# EAGLE design mux_board_final (EAGLE 6.6.0)
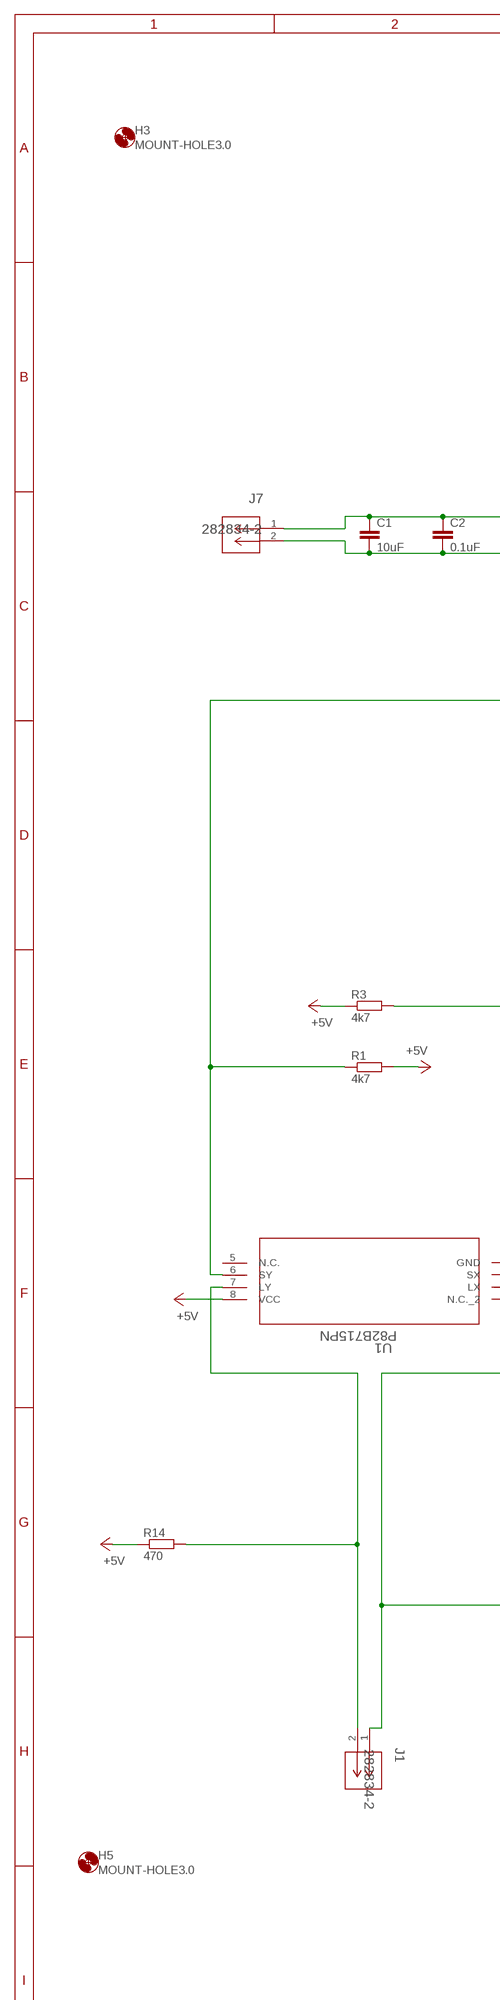
[diagram p0: schematic, sheet 1, part 1 of 2]
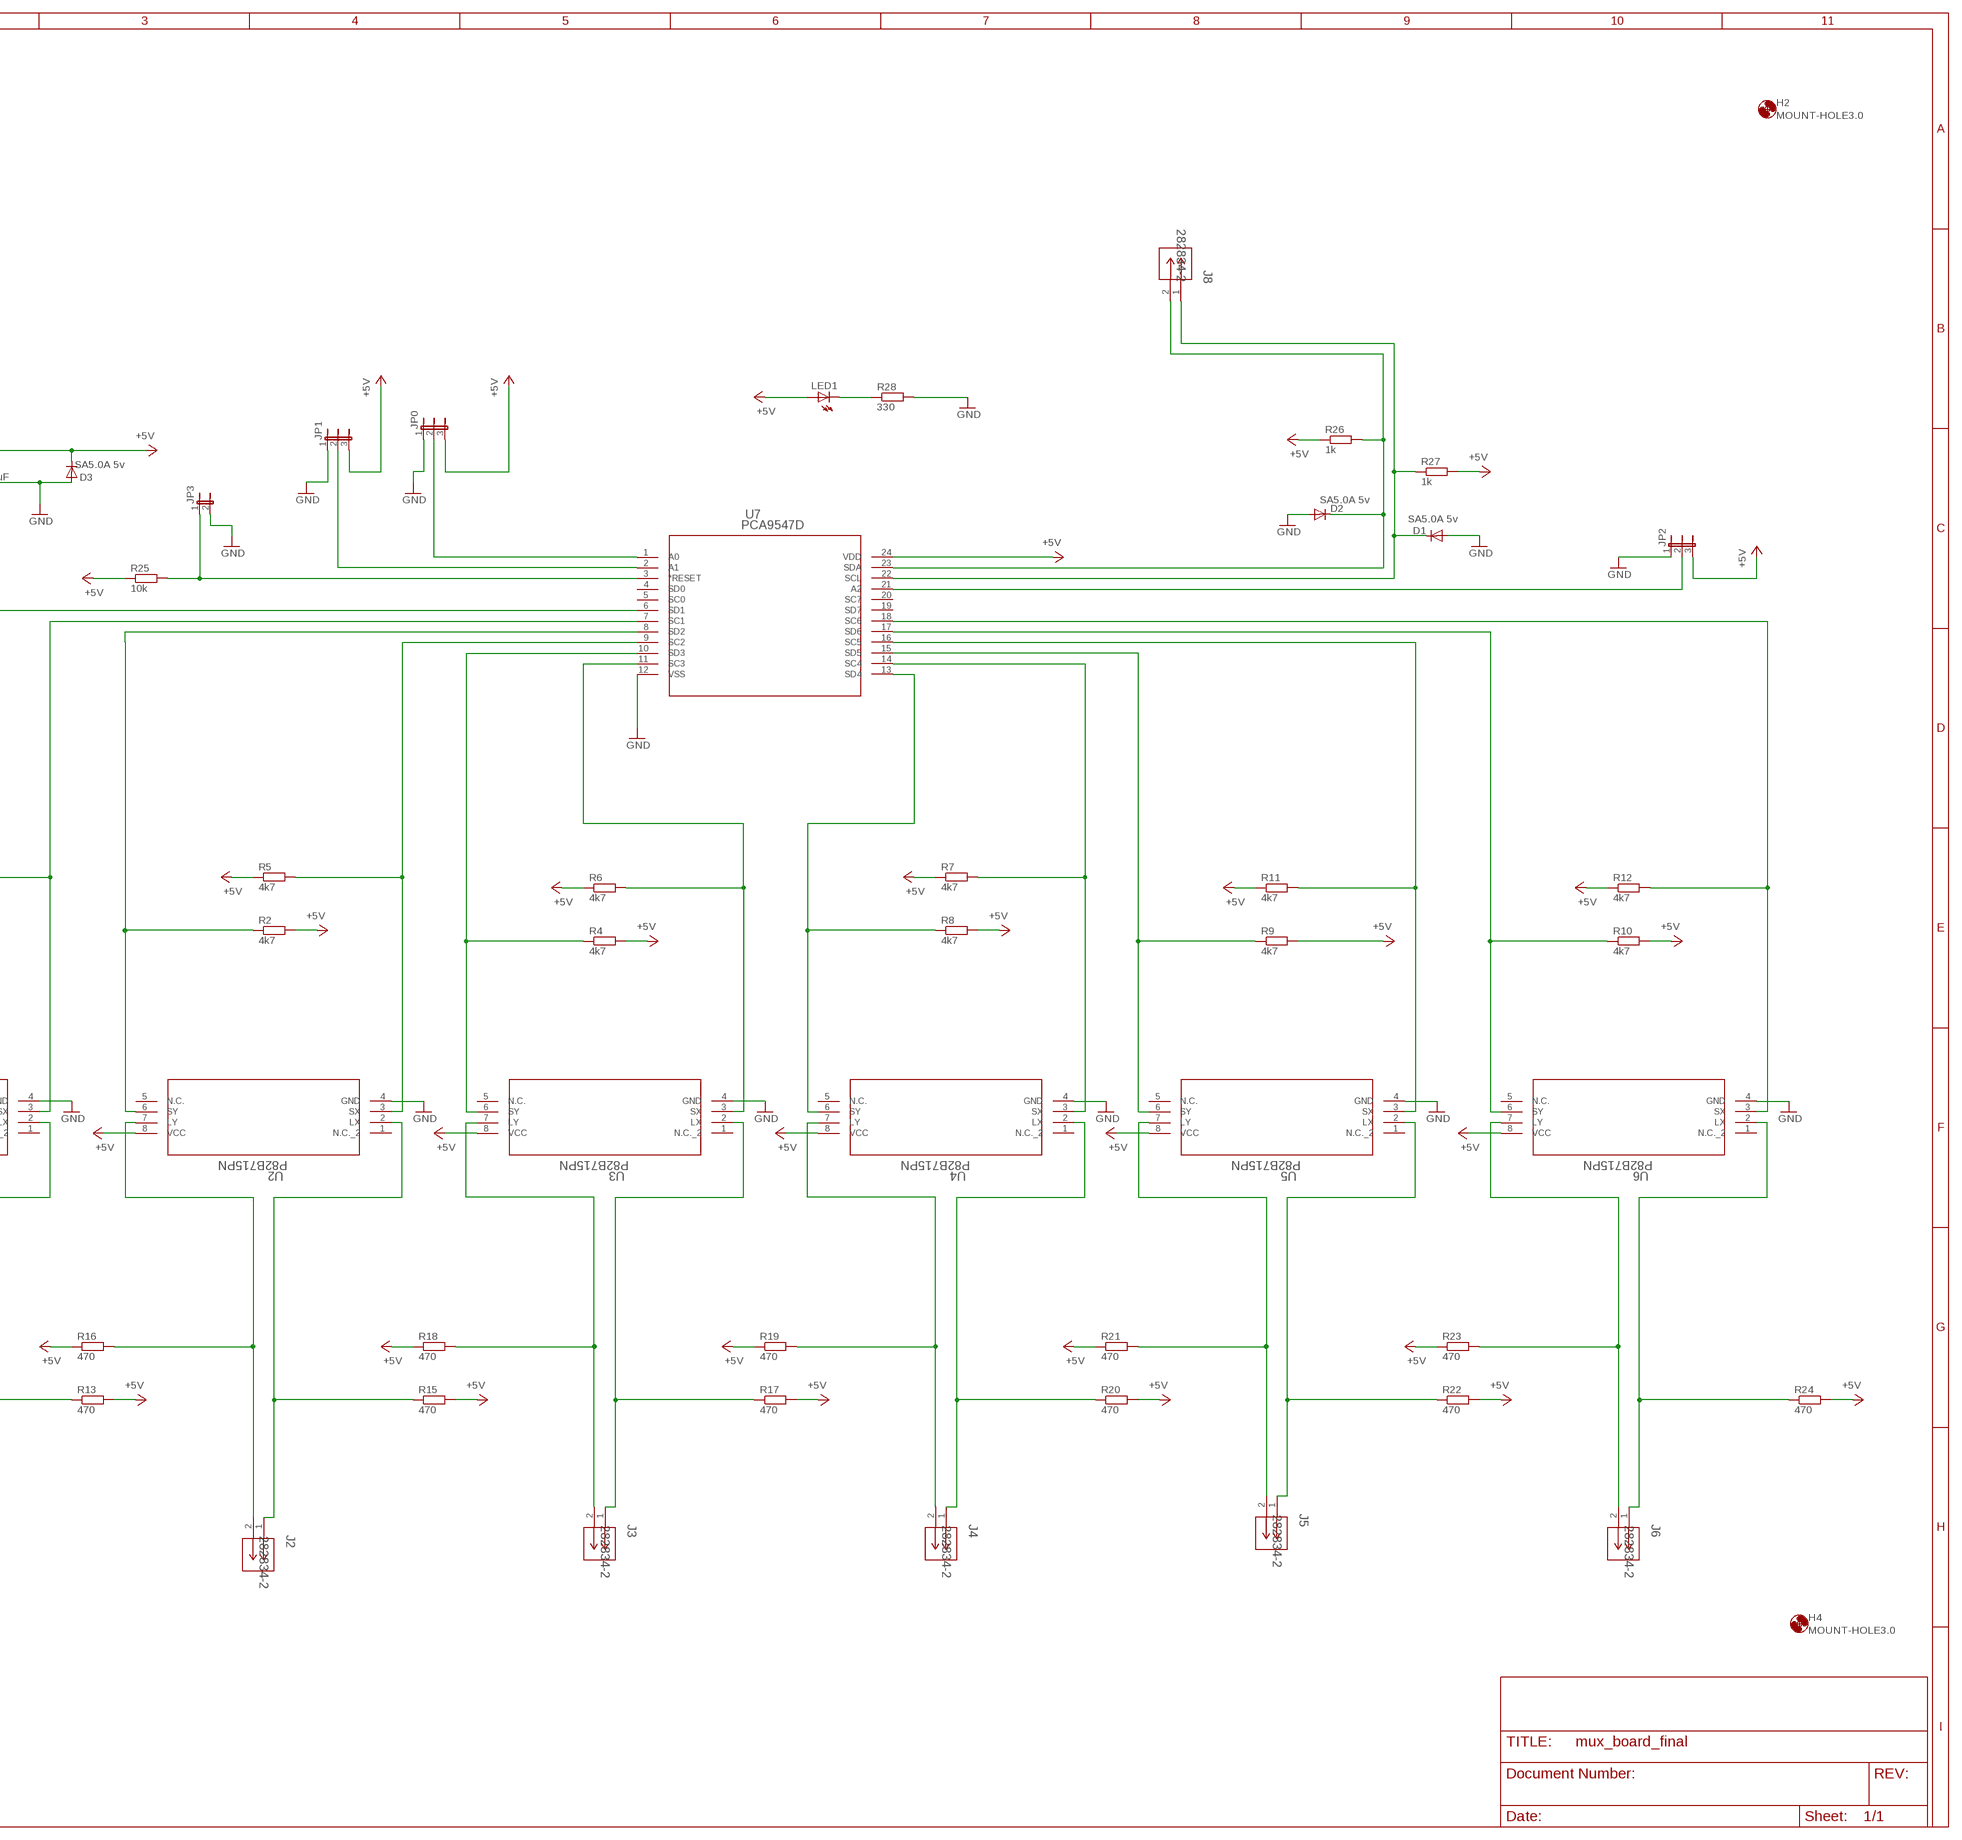
[diagram p1: schematic, sheet 1, part 2 of 2]

## Parts
C1  10uF  C-EU025-025X050  [C025-025X050]
C2  0.1uF  C-EU025-025X050  [C025-025X050]
D1  SA5.0A 5v  1N4004  [DO41-10]
D2  SA5.0A 5v  1N4004  [DO41-10]
D3  SA5.0A 5v  1N4004  [DO41-10]
H2  MOUNT-HOLE3.0  [3,0]
H3  MOUNT-HOLE3.0  [3,0]
H4  MOUNT-HOLE3.0  [3,0]
H5  MOUNT-HOLE3.0  [3,0]
J1  282834-2  [CONN_282834-2]
J2  282834-2  [CONN_282834-2]
J3  282834-2  [CONN_282834-2]
J4  282834-2  [CONN_282834-2]
J5  282834-2  [CONN_282834-2]
J6  282834-2  [CONN_282834-2]
J7  282834-2  [CONN_282834-2]
J8  282834-2  [CONN_282834-2]
JP0  JP2E  [JP2]
JP1  JP2E  [JP2]
JP2  JP2E  [JP2]
JP3  JP1E  [JP1]
LED1  LED3MM  [LED3MM]
R1  4k7  R-EU_0204/7  [0204/7]
R2  4k7  R-EU_0204/7  [0204/7]
R3  4k7  R-EU_0204/7  [0204/7]
R4  4k7  R-EU_0204/7  [0204/7]
R5  4k7  R-EU_0204/7  [0204/7]
R6  4k7  R-EU_0204/7  [0204/7]
R7  4k7  R-EU_0204/7  [0204/7]
R8  4k7  R-EU_0204/7  [0204/7]
R9  4k7  R-EU_0204/7  [0204/7]
R10  4k7  R-EU_0204/7  [0204/7]
R11  4k7  R-EU_0204/7  [0204/7]
R12  4k7  R-EU_0204/7  [0204/7]
R13  470  R-EU_0204/7  [0204/7]
R14  470  R-EU_0204/7  [0204/7]
R15  470  R-EU_0204/7  [0204/7]
R16  470  R-EU_0204/7  [0204/7]
R17  470  R-EU_0204/7  [0204/7]
R18  470  R-EU_0204/7  [0204/7]
R19  470  R-EU_0204/7  [0204/7]
R20  470  R-EU_0204/7  [0204/7]
R21  470  R-EU_0204/7  [0204/7]
R22  470  R-EU_0204/7  [0204/7]
R23  470  R-EU_0204/7  [0204/7]
R24  470  R-EU_0204/7  [0204/7]
R25  10k  R-EU_0204/7  [0204/7]
R26  1k  R-EU_0204/7  [0204/7]
R27  1k  R-EU_0204/7  [0204/7]
R28  330  R-EU_0204/7  [0204/7]
U1  P82B715PN  [SOT97-1]
U2  P82B715PN  [SOT97-1]
U3  P82B715PN  [SOT97-1]
U4  P82B715PN  [SOT97-1]
U5  P82B715PN  [SOT97-1]
U6  P82B715PN  [SOT97-1]
U7  PCA9547D  [SOT137-1]

## Nets
+5V: C1.1 C2.1 D3.C J7.1 JP0.3 JP1.3 JP2.3 LED1.A R1.2 R2.2 R3.1 R4.2 R5.1 R6.1 R7.1 R8.2 R9.2 R10.2 R11.1 R12.1 R13.2 R14.1 R15.2 R16.1 R17.2 R18.1 R19.1 R20.2 R21.1 R22.2 R23.1 R24.2 R25.1 R26.1 R27.2 U1.8(VCC) U2.8(VCC) U3.8(VCC) U4.8(VCC) U5.8(VCC) U6.8(VCC) U7.24(VDD)
GND: C1.2 C2.2 D1.A D2.A D3.A J7.2 JP0.1 JP1.1 JP2.1 JP3.2 R28.2 U1.4(GND) U2.4(GND) U3.4(GND) U4.4(GND) U5.4(GND) U6.4(GND) U7.12(VSS)
N$1: R1.1 U1.6(SY) U7.6(SD1)
N$2: R2.1 U2.6(SY) U7.8(SD2)
N$3: R3.2 U1.3(SX) U7.7(SC1)
N$4: R5.2 U2.3(SX) U7.9(SC2)
N$5: R4.1 U3.6(SY) U7.10(SD3)
N$6: R6.2 U3.3(SX) U7.11(SC3)
N$7: R8.1 U4.6(SY) U7.13(SD4)
N$8: R7.2 U4.3(SX) U7.14(SC4)
N$9: R9.1 U5.6(SY) U7.15(SD5)
N$10: R11.2 U5.3(SX) U7.16(SC5)
N$11: R10.1 U6.6(SY) U7.17(SD6)
N$12: R12.2 U6.3(SX) U7.18(SC6)
N$14: JP0.2 U7.1(A0)
N$15: JP1.2 U7.2(A1)
N$16: JP2.2 U7.21(A2)
N$19: J1.2 R14.2 U1.7(LY)
N$20: JP3.1 R25.2 U7.3(*RESET)
N$21: J2.2 R16.2 U2.7(LY)
N$22: J2.1 R15.1 U2.2(LX)
N$23: J3.2 R18.2 U3.7(LY)
N$24: J3.1 R17.1 U3.2(LX)
N$25: J4.2 R19.2 U4.7(LY)
N$26: J4.1 R20.1 U4.2(LX)
N$27: J5.2 R21.2 U5.7(LY)
N$28: J5.1 R22.1 U5.2(LX)
N$29: J6.2 R23.2 U6.7(LY)
N$30: J6.1 R24.1 U6.2(LX)
N$31: D1.C J8.1 R27.1 U7.22(SCL)
N$33: LED1.K(C) R28.1
N$34: D2.C J8.2 R26.2 U7.23(SDA)
TSR1: J1.1 R13.1 U1.2(LX)
Unconnected: U1.1(N.C._2) U1.5(N.C.) U2.1(N.C._2) U2.5(N.C.) U3.1(N.C._2) U3.5(N.C.) U4.1(N.C._2) U4.5(N.C.) U5.1(N.C._2) U5.5(N.C.) U6.1(N.C._2) U6.5(N.C.) U7.4(SD0) U7.5(SC0) U7.19(SD7) U7.20(SC7)

## Library data of the parts
C1 C2 = rcl:C-EU: CAPACITOR, European symbol
D1-D3 = diode:1N4004: DIODE general purpose rectifier, 1 A
H2-H5 = holes:MOUNT-HOLE: MOUNTING HOLE with drill center marker
J1-J8 = screw-terminals:282834-2: 2.54mm pitch; DESCRIPTION: Termi-Block 2 way pcb r/a; FAMILY: Terminal Blocks; MANUFACTURER_NAME: Tyco Electronics Amp; MANUFACTURER_PART_NUMBER: 282834-2; RSPARTNUMBER: 7100104; SECTION: General Purpose; SUPERSECTION: Connectors; VENDOR: Tyco Electronics
JP0 JP1 JP2 = jumper:JP2E: JUMPER
JP3 = jumper:JP1E: JUMPER
LED1 = led:LED: LED OSRAM: - CHIPLED LG R971, LG N971, LY N971, LG Q971, LY Q971, LO R971, LY R971 LH N974, LH R974 LS Q976, LO Q976, LY Q976 LO Q996 - Hyper CHIPLED LW Q18S LB Q993, LB Q99A, LB R99A - SideLED LS A670, LO A670, LY A670, LG A670, LP A670 LB A673, LV A673, LT A673, LW A673 LH A674 LY A675 LS A676, LA A676, LO A676, LY A676, LW A676 LS A679, LY A679, LG A679 - Hyper Micro SIDELED® LS Y876, LA Y876, LO Y876, LY Y876 LT Y87S - SmartLED LW L88C, LW L88S LB L89C, LB L89S, LG L890 LS L89K, LO L89K, LY L89K LS L896, LA L896, LO L896, LY L896 - TOPLED LS T670, LO T670, LY T670, LG T670, LP T670 LSG T670, LSP T670, LSY T670, LOP T670, LYG T670 LG T671, LOG T671, LSG T671 LB T673, LV T673, LT T673, LW T673 LH T674 LS T676, LA T676, LO T676, LY T676, LB T676, LH T676, LSB T676, LW T676 LB T67C, LV T67C, LT T67C, LS T67K, LO T67K, LY T67K, LW E67C LS E67B, LA E67B, LO E67B, LY E67B, LB E67C, LV E67C, LT E67C LW T67C LS T679, LY T679, LG T679 LS T770, LO T770, LY T770, LG T770, LP T770 LB T773, LV T773, LT T773, LW T773 LH T774 LS E675, LA E675, LY E675, LS T675 LS T776, LA T776, LO T776, LY T776, LB T776 LHGB T686 LT T68C, LB T68C - Hyper Mini TOPLED® LB M676 - Mini TOPLED Santana® LG M470 LS M47K, LO M47K, LY M47K Source: http://www.osram.convergy.de LUXEON: - LUMILED® LXK2-PW12-R00, LXK2-PW12-S00, LXK2-PW14-U00, LXK2-PW14-V00 LXK2-PM12-R00, LXK2-PM12-S00, LXK2-PM14-U00 LXK2-PE12-Q00, LXK2-PE12-R00, LXK2-PE12-S00, LXK2-PE14-T00, LXK2-PE14-U00 LXK2-PB12-K00, LXK2-PB12-L00, LXK2-PB12-M00, LXK2-PB14-N00, LXK2-PB14-P00, LXK2-PB14-Q00 LXK2-PR12-L00, LXK2-PR12-M00, LXK2-PR14-Q00, LXK2-PR14-R00 LXK2-PD12-Q00, LXK2-PD12-R00, LXK2-PD12-S00 LXK2-PH12-R00, LXK2-PH12-S00 LXK2-PL12-P00, LXK2-PL12-Q00, LXK2-PL12-R00 Source: www.luxeon.com KINGBRIGHT: KA-3528ASYC Source: www.kingbright.com
R1-R28 = rcl:R-EU_: RESISTOR, European symbol
U1-U6 = testlib:P82B715PN; DESCRIPTION: I2C bus extender/driver,P82B715PN DIL8; FAMILY: Unknown; MANUFACTURER_NAME: NXP; MANUFACTURER_PART_NUMBER: P82B715PN; RSPARTNUMBER: 821784; SECTION: Unknown; VENDOR: NXP
U7 = testlib:PCA9547D; DESCRIPTION: I2C Multiplexer 1Element 8IN 24P SO Tube; FAMILY: Unknown; MANUFACTURER_NAME: NXP; MANUFACTURER_PART_NUMBER: PCA9547D; RSPARTNUMBER: 7258877; SECTION: Unknown; VENDOR: NXP

## Net classes
0 default: clearance 0.205 mm

## Board
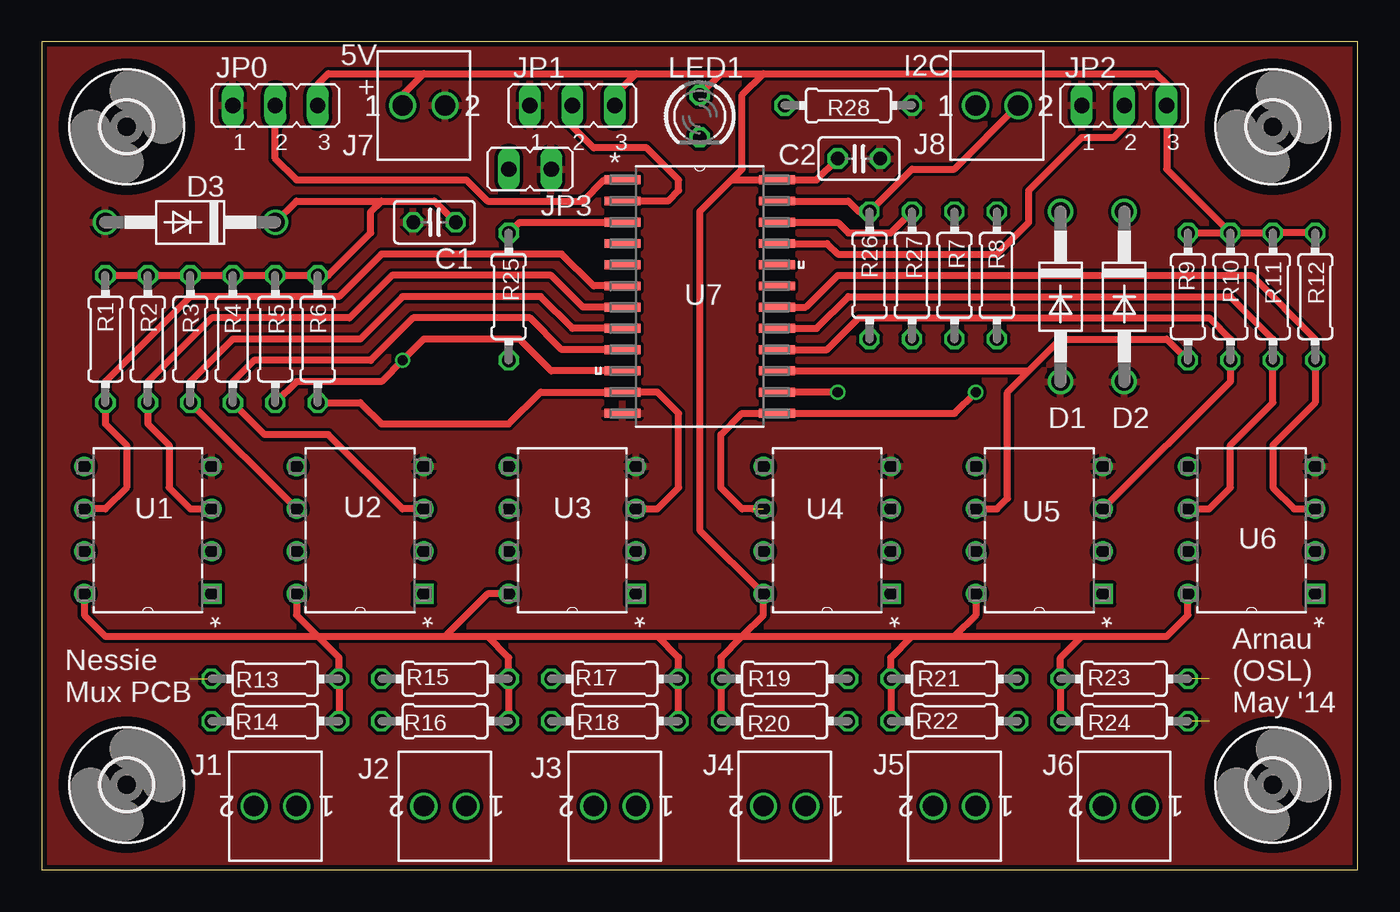
[diagram p2: board, top side]
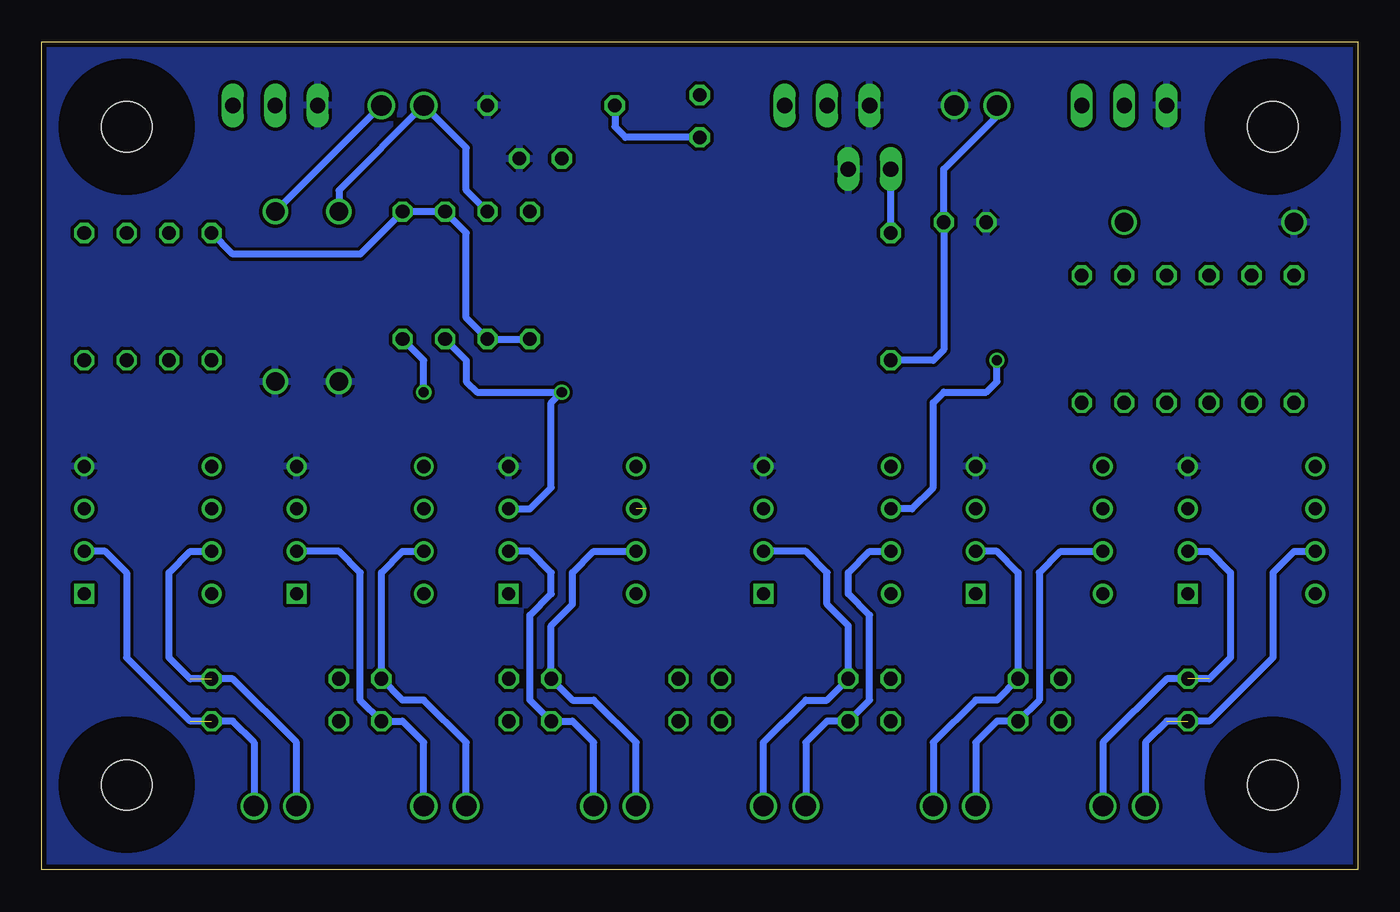
[diagram p3: board, bottom side, seen from below]

Size 78.74 x 49.53 mm. Coordinates in mm from the lower left corner, seen from the top.
Outline: 0,0 78.74,0 78.74,49.53 0,49.53 0,0
Copper layers (1*16): Top 0.035mm / dielectric 1.5mm / Bottom 0.035mm
Design rules "PCB-POOL Standard": minimum track width 0.15mm, minimum drill 0.3mm, track to track 0.15mm, track to pad 0.15mm, pad to pad 0.15mm, via to via 0.15mm, smd to smd 0.15mm, copper to edge 0.3mm, drill to drill 0.2mm, minimum pad ring 0.2mm, minimum via ring 0.15mm, stop-mask expansion 0.075mm, vias tented up to drill 0mil, thermal gap 0.2mm

### Footprints (pad centres in the part's own frame; a part is rotated, then mirrored left to right if it is on the bottom)
C025-025X050 = drill 0.813 octagon: 1 -1.27,0; 2 1.27,0
DO41-10 = drill 1.118: A 5.08,0; C -5.08,0
3,0 = hole 3: 0,0
CONN_282834-2 = drill 1.219: 1 -2.54,0; 2 0,0
JP2 = drill 0.914 long: 1 -2.54,0; 2 0,0; 3 2.54,0
JP1 = drill 0.914 long: 1 0,-1.27; 2 0,1.27
LED3MM = drill 0.813 octagon: A -1.27,0; K 1.27,0
0204/7 = drill 0.813 octagon: 1 -3.81,0; 2 3.81,0
SOT97-1 = drill 0.787 square: 1 -7.62,7.62 | drill 0.787: 2 -7.62,5.08; 3 -7.62,2.54; 4 -7.62,0; 5 0,0; 6 0,2.54; 7 0,5.08; 8 0,7.62
SOT137-1 = smd 2.134 x 0.533: 1 -4.623,6.985; 2 -4.623,5.715; 3 -4.623,4.445; 4 -4.623,3.175; 5 -4.623,1.905; 6 -4.623,0.635; 7 -4.623,-0.635; 8 -4.623,-1.905; 9 -4.623,-3.175; 10 -4.623,-4.445; 11 -4.623,-5.715; 12 -4.623,-6.985; 13 4.623,-6.985; 14 4.623,-5.715; 15 4.623,-4.445; 16 4.623,-3.175; 17 4.623,-1.905; 18 4.623,-0.635; 19 4.623,0.635; 20 4.623,1.905; 21 4.623,3.175; 22 4.623,4.445; 23 4.623,5.715; 24 4.623,6.985

### Placement (x,y rotation side)
C1  23.5,38.73 180 top
C2  48.9,42.55 0 top
D1  60.96,34.29 270 top
D2  64.77,34.29 270 top
D3  8.89,38.73 180 top
H2  73.66,44.45 0 top
H3  5.08,44.45 0 top
H4  73.66,5.08 0 top
H5  5.08,5.08 0 top
J1  12.7,3.81 180 top
J2  22.86,3.81 180 top
J3  33.02,3.81 180 top
J4  43.18,3.81 180 top
J5  53.34,3.81 180 top
J6  63.5,3.81 180 top
J7  24.13,45.72 0 top
J8  58.42,45.72 0 top
JP0  13.97,45.72 0 top
JP1  31.75,45.72 0 top
JP2  64.77,45.72 0 top
JP3  29.21,41.91 270 top
LED1  39.37,45.09 270 top
R1  3.81,31.75 90 top
R2  8.89,31.75 90 top
R3  6.35,31.75 270 top
R4  13.97,31.75 90 top
R5  11.43,31.75 270 top
R6  16.51,31.75 270 top
R7  54.61,35.56 270 top
R8  57.15,35.56 90 top
R9  68.58,34.29 90 top
R10  73.66,34.29 90 top
R11  71.12,34.29 270 top
R12  76.2,34.29 270 top
R13  13.97,11.43 0 top
R14  13.97,8.89 180 top
R15  24.13,11.43 0 top
R16  24.13,8.89 180 top
R17  34.29,11.43 0 top
R18  34.29,8.89 180 top
R19  44.45,11.43 0 top
R20  44.45,8.89 180 top
R21  54.61,11.43 0 top
R22  54.61,8.89 180 top
R23  64.77,11.43 0 top
R24  64.77,8.89 180 top
R25  27.94,34.29 90 top
R26  49.53,35.56 90 top
R27  52.07,35.56 270 top
R28  48.26,45.72 0 top
U1  2.54,24.13 180 top
U2  15.24,24.13 180 top
U3  27.94,24.13 180 top
U4  43.18,24.13 180 top
U5  55.88,24.13 180 top
U6  68.58,24.13 180 top
U7  39.37,34.29 0 top

### Tracks (layer width: path | path; a pad name or v marks a point on that pad's centre or on a via)
+5V
  Top 0.406: JP0.3 16.51,46.99 17.14,47.62 22.86,47.62 | R1.2 R3.1 R2.2 R5.1 R4.2 R6.1 17.14,35.56 19.68,38.1 19.68,39.37 20.32,40.01 | R9.2 R11.1 | R11.1 R10.2 R12.1 | U1.8 2.54,15.24 3.81,13.97 16.51,13.97 | 16.51,13.97 24.13,13.97 | 24.13,13.97 26.67,13.97 | 26.67,13.97 36.83,13.97 | 36.83,13.97 41.91,13.97 | 41.91,13.97 52.07,13.97 | 52.07,13.97 54.61,13.97 | 54.61,13.97 62.23,13.97 | 62.23,13.97 67.31,13.97 68.58,15.24 U6.8 | 41.91,13.97 43.18,15.24 U4.8 39.37,20.32 39.37,39.37 41.27,41.27 | U2.8 15.24,15.24 16.51,13.97 | R14.1 R13.2 17.78,12.7 16.51,13.97 | R16.1 R15.2 27.94,12.7 26.67,13.97 | R18.1 R17.2 38.1,12.7 36.83,13.97 | R20.2 R19.1 40.64,12.7 41.91,13.97 | R22.2 R21.1 50.8,12.7 52.07,13.97 | R24.2 R23.1 60.96,12.7 62.23,13.97 | U3.8 26.67,16.51 24.13,13.97 | U5.8 55.88,15.24 54.61,13.97 | 41.27,41.27 U7.24 46.35,41.27 C2.1 | C1.1 23.5,40.01 20.32,40.01 | 22.86,47.62 35.56,47.62 | 35.56,47.62 40.64,47.62 | 40.64,47.62 43.18,47.62 | 43.18,47.62 66.67,47.62 67.31,46.99 JP2.3 67.31,41.91 R11.1 | 41.27,41.27 41.91,41.91 41.91,46.35 43.18,47.62 | JP1.3 34.29,46.35 35.56,47.62 | LED1.A 40.64,47.62 | D3.C 15.24,40.01 20.32,40.01 | J7.1 21.59,46.35 22.86,47.62
  Bottom 0.406: R26.1 R27.2 53.34,33.02 53.34,38.1 R7.1 R8.2 59.69,36.83 67.31,36.83 R9.2 | R25.1 25.4,30.48 24.77,31.11 C1.1 24.77,41.91 21.59,45.09 J7.1
GND
  Top 0.406: U7.12 35.56,27.3
  pour Bottom: -1.27,-1.27 -1.27,50.8 80.01,50.8 80.01,-1.27
  pour Top: -1.27,50.8 -1.27,-1.27 80.01,-1.27 80.01,50.8
N$1
  Top 0.406: U7.6 33.02,34.92 31.11,36.83 20.32,36.83 17.78,34.29 8.89,34.29 3.81,29.21 R1.1 3.81,26.67 5.08,25.4 5.08,22.86 3.81,21.59 U1.6
N$2
  Top 0.406: U7.8 31.75,32.38 29.84,34.29 21.59,34.29 19.05,31.75 11.43,31.75 8.89,29.21 R2.1 U2.6
N$3
  Top 0.406: U7.7 32.38,33.66 30.48,35.56 20.95,35.56 18.41,33.02 10.16,33.02 6.35,29.21 R3.2 6.35,26.67 7.62,25.4 7.62,22.86 8.89,21.59 U1.3
N$4
  Top 0.406: U7.9 31.11,31.11 29.21,33.02 22.23,33.02 19.68,30.48 12.7,30.48 11.43,29.21 R5.2 13.34,26.04 17.14,26.04 21.59,21.59 U2.3
N$5  (via drill 0.6)
  Top 0.406: 35.56,29.84 U7.10 30.48,29.84 28.57,31.75 22.86,31.75 v21.59,30.48 20.32,29.21 15.24,29.21 R4.1
  Bottom 0.406: U3.6 26.67,21.59 25.4,22.86 25.4,27.94 24.77,28.57 22.23,28.57 21.59,29.21 v21.59,30.48
N$6
  Top 0.406: U3.3 36.83,21.59 38.1,22.86 38.1,27.3 36.83,28.57 U7.11 29.84,28.57 27.94,26.67 20.32,26.67 19.05,27.94 R6.2
N$7  (via drill 0.6)  (1 unrouted)
  Top 0.406: 42.55,21.59 41.91,21.59 40.64,22.86 40.64,26.04 41.91,27.3 U7.13 54.61,27.3 v55.88,28.57
  Bottom 0.406: v55.88,28.57 55.88,30.48 R8.1
N$8  (via drill 0.6)
  Top 0.406: v47.62,28.57 U7.14
  Bottom 0.406: R7.2 53.34,30.48 53.34,29.21 52.7,28.57 v47.62,28.57 48.26,27.94 48.26,22.86 49.53,21.59 U4.3
N$9
  Top 0.406: U5.6 57.15,21.59 57.78,22.23 57.78,28.57 59.05,29.84 | U7.15 59.05,29.84 | 59.05,29.84 60.96,31.75 67.31,31.75 R9.1
N$10
  Top 0.406: U7.16 46.99,31.11 48.9,33.02 69.85,33.02 71.12,31.75 R11.2 71.12,29.21 U5.3
N$11
  Top 0.406: U7.17 46.35,32.38 48.26,34.29 71.12,34.29 73.66,31.75 R10.1 73.66,27.94 71.12,25.4 71.12,22.86 69.85,21.59 U6.6
N$12
  Top 0.406: U7.18 45.72,33.66 47.62,35.56 72.39,35.56 76.2,31.75 R12.2 76.2,27.94 73.66,25.4 73.66,22.86 74.93,21.59 U6.3
N$14
  Top 0.406: JP0.2 13.97,42.55 15.24,41.27 25.4,41.27 26.67,40.01 32.38,40.01 33.66,41.27 U7.1
N$15
  Top 0.406: U7.2 37.47,40.01 38.1,40.64 38.1,41.27 36.2,43.18 33.02,43.18 31.75,44.45 JP1.2
N$16
  Top 0.406: U7.21 46.99,37.47 47.62,36.83 57.15,36.83 59.05,38.73 59.05,40.64 62.23,43.81 64.14,43.81 64.77,44.45 JP2.2
N$19  (1 unrouted)
  Bottom 0.406: J1.2 12.7,7.62 11.43,8.89 8.89,8.89 5.08,12.7 5.08,17.78 3.81,19.05 U1.7
N$20
  Top 0.406: R25.2 28.57,38.73 U7.3
  Bottom 0.406: R25.2 JP3.1
N$21
  Bottom 0.406: J2.2 22.86,7.62 21.59,8.89 R16.2 19.05,10.16 19.05,17.78 17.78,19.05 U2.7
N$22
  Bottom 0.406: J2.1 25.4,7.62 22.86,10.16 21.59,10.16 R15.1 20.32,17.78 21.59,19.05 U2.2
N$23
  Bottom 0.406: J3.2 33.02,7.62 31.75,8.89 R18.2 29.21,10.16 29.21,15.24 30.48,16.51 30.48,17.78 29.21,19.05 U3.7
N$24
  Bottom 0.406: J3.1 35.56,7.62 33.02,10.16 31.75,10.16 R17.1 30.48,14.61 31.75,15.88 31.75,17.78 33.02,19.05 U3.2
N$25
  Bottom 0.406: J4.2 43.18,7.62 45.72,10.16 46.99,10.16 R19.2 48.26,14.61 46.99,15.88 46.99,17.78 45.72,19.05 U4.7
N$26
  Bottom 0.406: J4.1 45.72,7.62 46.99,8.89 R20.1 49.53,10.16 49.53,15.24 48.26,16.51 48.26,17.78 49.53,19.05 U4.2
N$27
  Bottom 0.406: J5.2 53.34,7.62 55.88,10.16 57.15,10.16 R21.2 58.42,17.78 57.15,19.05 U5.7
N$28
  Bottom 0.406: J5.1 55.88,7.62 57.15,8.89 R22.1 59.69,10.16 59.69,17.78 60.96,19.05 U5.2
N$29  (1 unrouted)
  Bottom 0.406: J6.2 63.5,7.62 67.31,11.43 69.85,11.43 71.12,12.7 71.12,17.78 69.85,19.05 U6.7
N$30  (1 unrouted)
  Bottom 0.406: J6.1 66.04,7.62 67.31,8.89 69.85,8.89 73.66,12.7 73.66,17.78 74.93,19.05 U6.2
N$31
  Top 0.406: U7.22 47.62,38.73 48.26,38.1 50.8,38.1 R27.1
  Bottom 0.406: R27.1 53.34,40.64 53.34,43.18 J8.1 60.96,40.64 D1.C
N$33
  Bottom 0.406: R28.1 44.45,44.45 43.81,43.81 LED1.K
N$34
  Top 0.406: U7.23 48.26,40.01 48.9,39.37 R26.2 52.07,41.91 54.61,41.91 J8.2
  Bottom 0.406: J8.2 D2.C
TSR1  (1 unrouted)
  Bottom 0.406: U1.2 8.89,19.05 7.62,17.78 7.62,12.7 8.89,11.43 11.43,11.43 15.24,7.62 J1.1

### Text on the board
tNames: I2C | 5V / + | Nessie / Mux PCB | Arnau / (OSL) / May '14